# Altium project PCB_Project1.PrjPCB
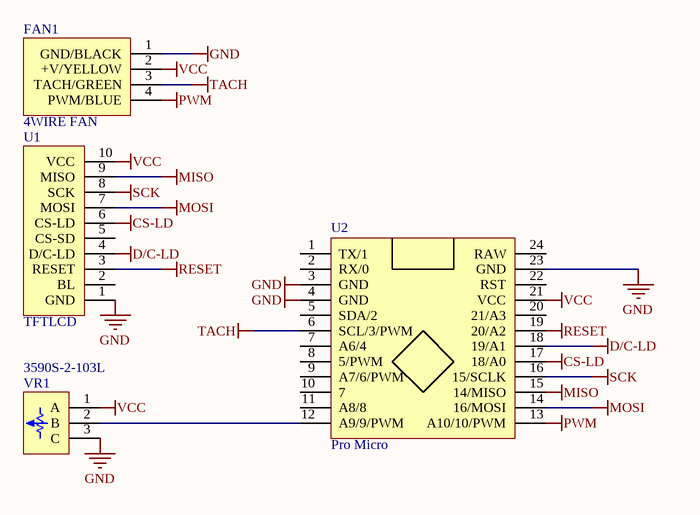
[diagram p0: Sheet1.SchDoc]
1 sheet, 4 parts. Net scope: global (net labels, ports and power ports of the same name join across sheets).
Board file: PCB1.PcbDoc

## Sheet Sheet1.SchDoc
size A4

### Parts
FAN1  4WIRE FAN  [WR-WTB 2,54mm 1X4]
U1  TFTLCD  [TFTLCD]
U2  Pro Micro  [ProMicro]
VR1  3590S-2-103L  [WR-WTB 2,54mm 1X3]

### Nets
CS-LD: U1.6(CS-LD) U2.17(18/A0)
D/C-LD: U1.4(D/C-LD) U2.18(19/A1)
GND: FAN1.1(GND/BLACK) U1.1(GND) U2.3(GND) U2.4(GND) U2.23(GND) VR1.3(C)
MISO: U1.9(MISO) U2.15(14/MISO)
MOSI: U1.7(MOSI) U2.14(16/MOSI)
PWM: FAN1.4(PWM/BLUE) U2.13(A10/10/PWM)
RESET: U1.3(RESET) U2.19(20/A2)
SCK: U1.8(SCK) U2.16(15/SCLK)
TACH: FAN1.3(TACH/GREEN) U2.6(SCL/3/PWM)
VCC: FAN1.2(+V/YELLOW) U1.10(VCC) U2.21(VCC) VR1.1(A)
NetU2_12: U2.12(A9/9/PWM) VR1.2(B)

Not connected (* = marked no-connect by the designer): U1 2(BL) 5(CS-SD); U2 1(TX/1) 2(RX/0) 5(SDA/2) 7(A6/4) 8(5/PWM) 9(A7/6/PWM) 10(7) 11(A8/8) 20(21/A3) 22(RST) 24(RAW)

### Library data of the parts
FAN1 = 4-WIRE_FAN
U2 = ProMicro